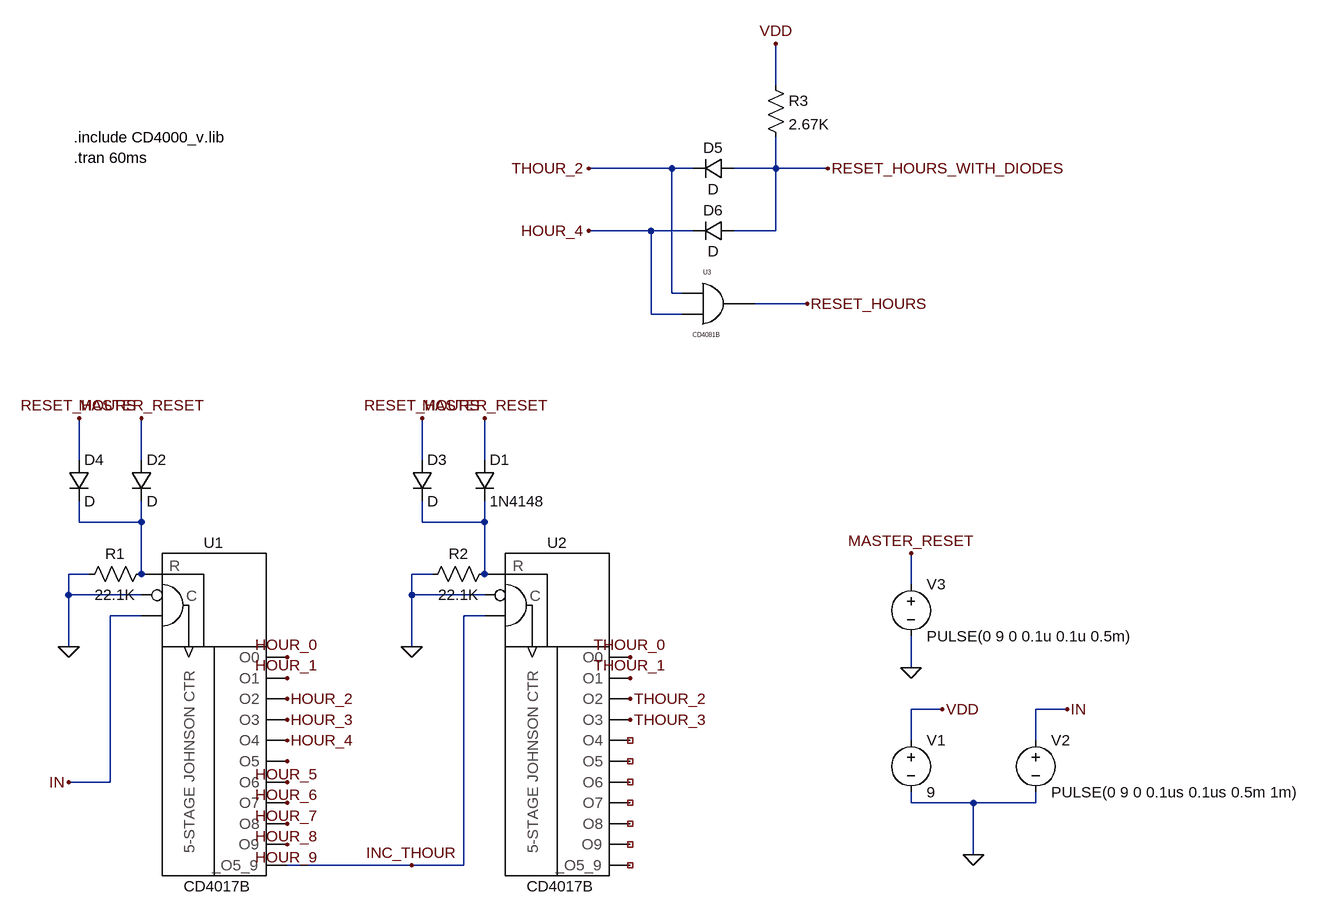
[diagram p0: schematic hours.asc]
hours.asc, the LTspice schematic file:
Version 4
SHEET 1 2508 832
WIRE 1440 -416 1440 -480
WIRE 1280 -288 1152 -288
WIRE 1312 -288 1280 -288
WIRE 1440 -288 1440 -336
WIRE 1440 -288 1376 -288
WIRE 1520 -288 1440 -288
WIRE 1248 -192 1152 -192
WIRE 1312 -192 1248 -192
WIRE 1440 -192 1440 -288
WIRE 1440 -192 1376 -192
WIRE 1280 -96 1280 -288
WIRE 1296 -96 1280 -96
WIRE 1488 -80 1408 -80
WIRE 1248 -64 1248 -192
WIRE 1296 -64 1248 -64
WIRE 368 160 368 96
WIRE 464 160 464 96
WIRE 896 160 896 96
WIRE 992 160 992 96
WIRE 368 256 368 224
WIRE 464 256 464 224
WIRE 464 256 368 256
WIRE 896 256 896 224
WIRE 992 256 992 224
WIRE 992 256 896 256
WIRE 384 336 352 336
WIRE 464 336 464 256
WIRE 912 336 880 336
WIRE 992 336 992 256
WIRE 1648 352 1648 304
WIRE 352 368 352 336
WIRE 464 368 352 368
WIRE 880 368 880 336
WIRE 992 368 880 368
WIRE 464 400 416 400
WIRE 992 400 960 400
WIRE 352 448 352 368
WIRE 880 448 880 368
WIRE 1648 480 1648 432
WIRE 1696 544 1648 544
WIRE 1888 544 1840 544
WIRE 1648 592 1648 544
WIRE 1840 592 1840 544
WIRE 416 656 416 400
WIRE 416 656 352 656
WIRE 1648 688 1648 672
WIRE 1744 688 1648 688
WIRE 1840 688 1840 672
WIRE 1840 688 1744 688
WIRE 1744 768 1744 688
WIRE 880 784 688 784
WIRE 960 784 960 400
WIRE 960 784 880 784
FLAG 352 656 IN
FLAG 352 448 0
FLAG 880 448 0
FLAG 688 592 HOUR_4
FLAG 688 624 HOUR_5
FLAG 688 464 HOUR_0
FLAG 1216 528 THOUR_2
FLAG 896 96 RESET_HOURS
FLAG 1216 464 THOUR_0
FLAG 1216 496 THOUR_1
FLAG 1216 560 THOUR_3
FLAG 464 96 MASTER_RESET
FLAG 992 96 MASTER_RESET
FLAG 688 496 HOUR_1
FLAG 688 528 HOUR_2
FLAG 688 560 HOUR_3
FLAG 688 656 HOUR_6
FLAG 688 688 HOUR_7
FLAG 688 720 HOUR_8
FLAG 688 752 HOUR_9
FLAG 880 784 INC_THOUR
FLAG 1520 -288 RESET_HOURS_WITH_DIODES
FLAG 1152 -288 THOUR_2
FLAG 1152 -192 HOUR_4
FLAG 1744 768 0
FLAG 1696 544 VDD
FLAG 1888 544 IN
FLAG 1648 304 MASTER_RESET
FLAG 1648 480 0
FLAG 368 96 RESET_HOURS
FLAG 1440 -480 VDD
FLAG 1488 -80 RESET_HOURS
SYMBOL CD4017B 576 272 R0
SYMATTR InstName U1
SYMBOL CD4017B 1104 272 R0
SYMATTR InstName U2
SYMBOL res 480 320 R90
WINDOW 0 0 56 VBottom 2
WINDOW 3 32 56 VTop 2
SYMATTR InstName R1
SYMATTR Value 22.1K
SYMBOL res 1008 320 R90
WINDOW 0 0 56 VBottom 2
WINDOW 3 32 56 VTop 2
SYMATTR InstName R2
SYMATTR Value 22.1K
SYMBOL diode 976 160 R0
SYMATTR InstName D1
SYMATTR Value 1N4148
SYMBOL diode 448 160 R0
SYMATTR InstName D2
SYMBOL diode 880 160 R0
SYMATTR InstName D3
SYMBOL voltage 1648 576 R0
SYMATTR InstName V1
SYMATTR Value 9
SYMBOL voltage 1840 576 R0
SYMATTR InstName V2
SYMATTR Value PULSE(0 9 0 0.1us 0.1us 0.5m 1m)
SYMBOL voltage 1648 336 R0
SYMATTR InstName V3
SYMATTR Value PULSE(0 9 0 0.1u 0.1u 0.5m)
SYMBOL diode 352 160 R0
SYMATTR InstName D4
SYMBOL diode 1376 -304 R90
WINDOW 0 0 32 VBottom 2
WINDOW 3 32 32 VTop 2
SYMATTR InstName D5
SYMBOL diode 1376 -208 R90
WINDOW 0 0 32 VBottom 2
WINDOW 3 32 32 VTop 2
SYMATTR InstName D6
SYMBOL res 1424 -432 R0
SYMATTR InstName R3
SYMATTR Value 2.67K
SYMBOL CD4081B 1344 -144 R0
SYMATTR InstName U3
TEXT 360 -336 Left 2 !.include CD4000_v.lib\n.tran 60ms

The netlist it stands for:
* hours.asc
XU1 N001 0 IN HOUR_0 HOUR_1 HOUR_2 HOUR_3 HOUR_4 HOUR_5 HOUR_6 HOUR_7 HOUR_8 HOUR_9 INC_THOUR VDD 0 CD4017B VDD=5  SPEED=1.0  TRIPDT=5e-9  ; pins MR CPN CP Q0 Q1 Q2 Q3 Q4 Q5 Q6 Q7 Q8 Q9 Q59
XU2 N002 0 INC_THOUR THOUR_0 THOUR_1 THOUR_2 THOUR_3 NC_01 NC_02 NC_03 NC_04 NC_05 NC_06 NC_07 VDD 0 CD4017B VDD=5  SPEED=1.0  TRIPDT=5e-9  ; pins MR CPN CP Q0 Q1 Q2 Q3 Q4 Q5 Q6 Q7 Q8 Q9 Q59
R1 N001 0 22.1K
R2 N002 0 22.1K
D1 MASTER_RESET N002 1N4148
D2 MASTER_RESET N001 D
D3 RESET_HOURS N002 D
V1 VDD 0 9
V2 IN 0 PULSE(0 9 0 0.1us 0.1us 0.5m 1m)
V3 MASTER_RESET 0 PULSE(0 9 0 0.1u 0.1u 0.5m)
D4 RESET_HOURS N001 D
D5 RESET_HOURS_WITH_DIODES THOUR_2 D
D6 RESET_HOURS_WITH_DIODES HOUR_4 D
R3 VDD RESET_HOURS_WITH_DIODES 2.67K
XU3 THOUR_2 HOUR_4 RESET_HOURS VDD 0 CD4081B VDD=5  SPEED=1.0  TRIPDT=5e-9  ; pins A B Y
.model D D
.lib standard.dio
.include CD4000_v.lib
.tran 60ms
.backanno
.end